# Altium schematic sheet BANK0.SchDoc: BANK0
size A4; DrawnBy: nand; Revision: V0.1; SheetNumber: 3; SheetTotal: 13
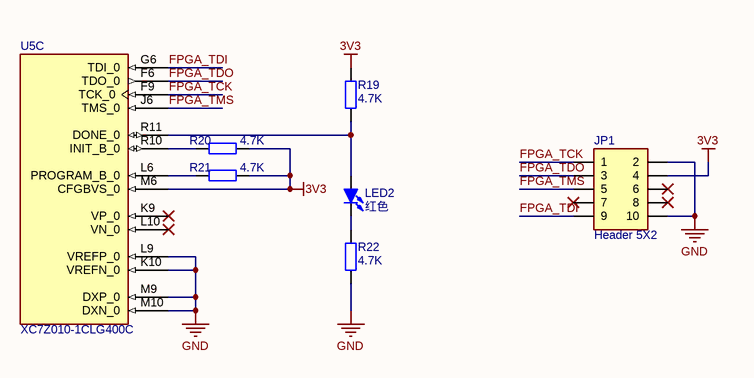
[diagram p0: BANK0.SchDoc]

## Parts
JP1  Header 5X2  [IDC2.54-LI-2x5P]
LED2  红色  [LED 0805G]
R19  4.7K  [R 0402_L]
R20  4.7K  [R 0402_L]
R21  4.7K  [R 0402_L]
R22  4.7K  [R 0402_L]
U5  XC7Z010-1CLG400C  [CLG400]  (part C of 9)

## Nets
3V3: JP1.4 R19.2 R20.1 R21.1 U5.M6(CFGBVS_0)
GND: JP1.2 JP1.10 R22.1 U5.K10(VREFN_0) U5.L9(VREFP_0) U5.M9(DXP_0) U5.M10(DXN_0)
FPGA_TCK: JP1.1 U5.F9(TCK_0)
FPGA_TDI: JP1.9 U5.G6(TDI_0)
FPGA_TDO: JP1.3 U5.F6(TDO_0)
FPGA_TMS: JP1.5 U5.J6(TMS_0)
NetLED2_1: LED2.1(A) R19.1 U5.R11(DONE_0)
NetLED2_2: LED2.2(K) R22.2
NetR20_2: R20.2 U5.R10(INIT_B_0)
NetR21_2: R21.2 U5.L6(PROGRAM_B_0)

Not connected (* = marked no-connect by the designer): JP1 6* 7* 8*; U5 K9(VP_0)* L10(VN_0)*

## Library data of the parts
JP1 = Header 5X2: 5*2P接插件; 版权归属: 源创客; BOM名称: 5*2P接插件; 学习资源: www.ooocke.com
LED2 = LED-SMD: 贴片LED; 版权归属: 源创客; BOM名称: 贴片LED; 学习资源: www.ooocke.com
R19-R22 = R: 贴片电阻; 版权归属: 源创客; BOM名称: 贴片电阻; 学习资源: www.ooocke.com
U5 = XC7Z010-1CLG400C: ZYNQ7000芯片